# Altium project WMCB-V2_Project.PrjPCB
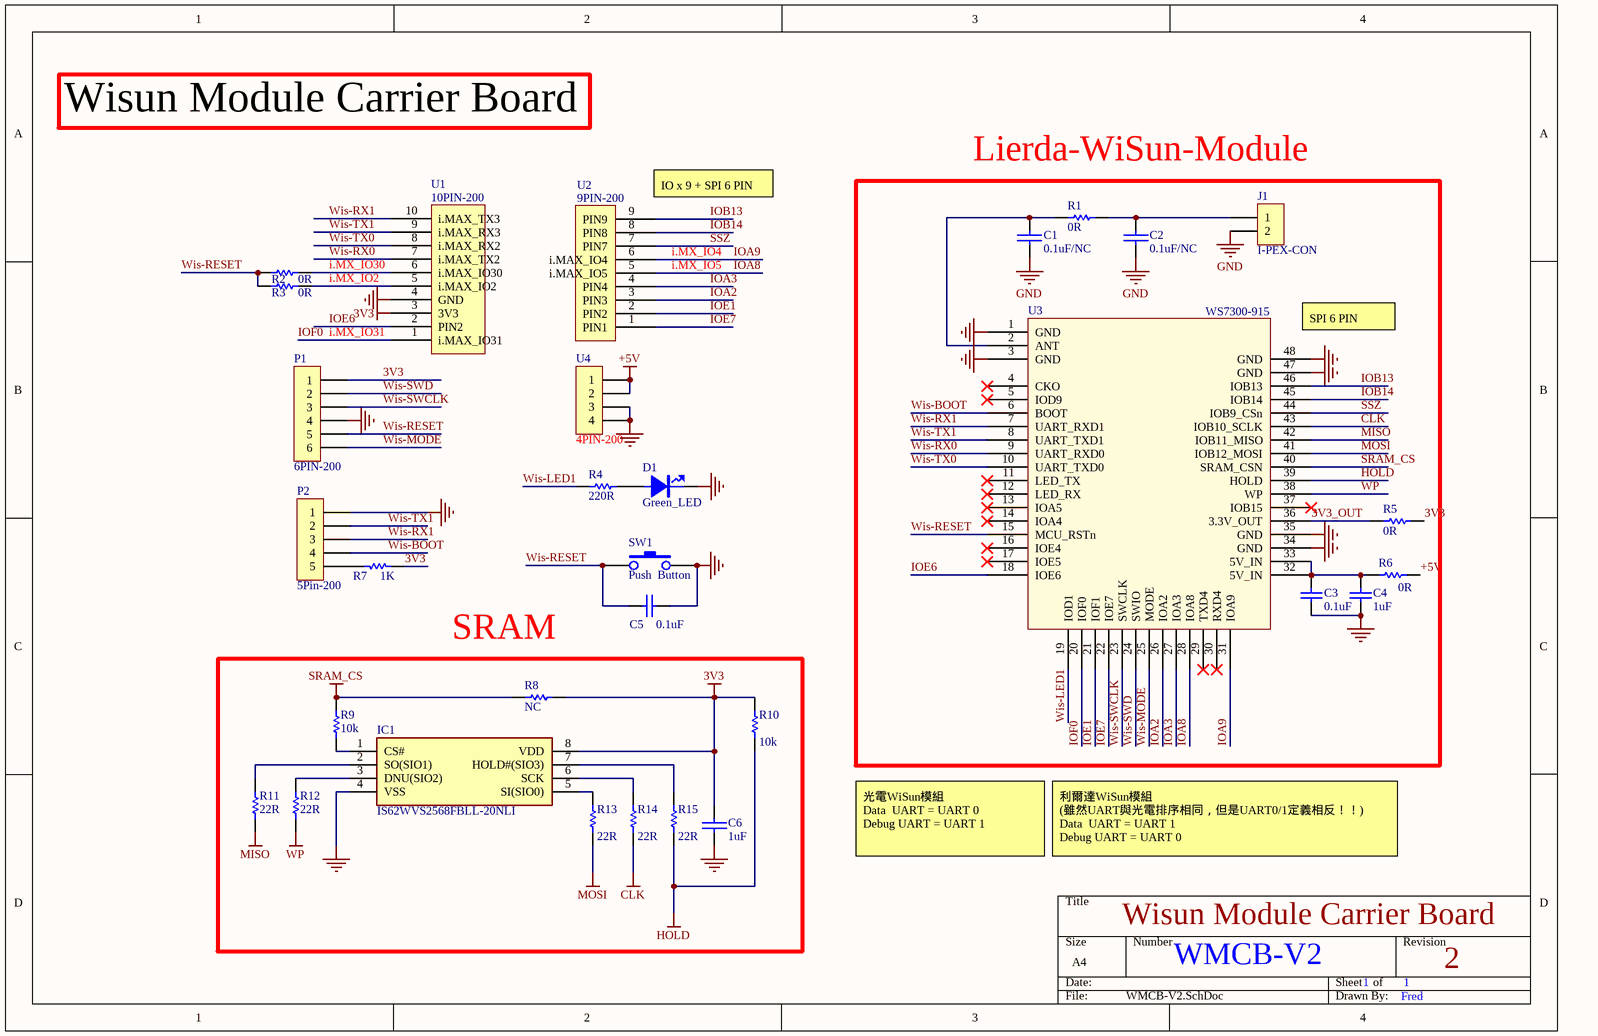
[diagram p0: WMCB-V2.SchDoc]
1 sheet, 31 parts. Net scope: global (net labels, ports and power ports of the same name join across sheets).
Board file: WMCB-V2.PcbDoc

## Sheet WMCB-V2.SchDoc
size A4

### Parts
C1  0.1uF/NC  [0402C]
C2  0.1uF/NC  [0402C]
C3  0.1uF  [0603C]
C4  value 1uF  [0603C]  (hidden comment: 0.1uF)
C5  0.1uF  [0402C]
C6  1uF  [0402C]
D1  Green_LED  [LED0603--0.4mm]
IC1  IS62WVS2568FBLL-20NLI  [SOIC127P600X175-8N]
J1  I-PEX-CON  [I-PEX-CON]
P1  6PIN-200  [6PIN-200]
P2  5Pin-200  [5pin-200]
R1  0R  [0603]
R2  0R  [0402]
R3  0R  [0402]
R4  220R  [0402]
R5  0R  [0603]
R6  0R  [0603]
R7  1K  [0402]
R8  NC  [0402]
R9  10k  [0402]
R10  10k  [0402]
R11  22R  [0402]
R12  22R  [0402]
R13  22R  [0402]
R14  22R  [0402]
R15  22R  [0402]
SW1  Push  Button  [Button_2pin-3*4*2MM]
U1  10PIN-200  [10PIN-200]
U2  9PIN-200  [9PIN-200]
U3  WS7300-915  [WiSun-Lierda]
U4  4PIN-200  [4PIN-200]

### Blocks framed on the sheet
Lierda-WiSun-Module: C1-C4 J1 R1 R5 R6 U3
SRAM: C6 IC1 R8-R15

### Nets
3V3: C6.2 IC1.8(VDD) P1.1 R5.1 R7.1 R8.1 R10.2 U1.3(3V3)
+5V: R6.1 U4.1 U4.2
CLK: R14.1 U3.43(IOB10_SCLK)
GND: C1.1 C2.1 C3.1 C4.2 C5.2 C6.1 D1.2 IC1.4(VSS) J1.2 P1.4 P2.1 SW1.2 U1.4(GND) U3.1(GND) U3.3(GND) U3.34(GND) U3.35(GND) U3.47(GND) U3.48(GND) U4.3 U4.4
HOLD: R10.1 R15.1 U3.39(HOLD)
MISO: R11.2 U3.42(IOB11_MISO)
MOSI: R13.1 U3.41(IOB12_MOSI)
SRAM_CS: R8.2 R9.1 U3.40(SRAM_CSN)
WP: R12.1 U3.38(WP)
3V3_OUT: R5.2 U3.36(3.3V_OUT)
i.MX_IO2: R3.1 U1.5(i.MAX_IO2)
i.MX_IO4: U2.6(i.MAX_IO4) U3.31(IOA9)  [also labelled IOA9]
i.MX_IO5: U2.5(i.MAX_IO5) U3.28(IOA8)  [also labelled IOA8]
i.MX_IO30: R2.1 U1.6(i.MAX_IO30)
i.MX_IO31: U1.1(i.MAX_IO31) U3.20(IOF0)  [also labelled IOF0]
IOA2: U2.3(PIN3) U3.26(IOA2)
IOA3: U2.4(PIN4) U3.27(IOA3)
IOB13: U2.9(PIN9) U3.46(IOB13)
IOB14: U2.8(PIN8) U3.45(IOB14)
IOE1: U2.2(PIN2) U3.21(IOF1)
IOE6: U1.2(PIN2) U3.18(IOE6)
IOE7: U2.1(PIN1) U3.22(IOE7)
SSZ: U2.7(PIN7) U3.44(IOB9_CSn)
Wis-BOOT: P2.4 U3.6(BOOT)
Wis-LED1: R4.2 U3.19(IOD1)
Wis-MODE: P1.6 U3.25(MODE)
Wis-RESET: C5.1 P1.5 R2.2 R3.2 SW1.1 U3.15(MCU_RSTn)
Wis-RX0: U1.7(i.MAX_TX2) U3.9(UART_RXD0)
Wis-RX1: P2.3 U1.10(i.MAX_TX3) U3.7(UART_RXD1)
Wis-SWCLK: P1.3 U3.23(SWCLK)
Wis-SWD: P1.2 U3.24(SWIO)
Wis-TX0: U1.8(i.MAX_RX2) U3.10(UART_TXD0)
Wis-TX1: P2.2 U1.9(i.MAX_RX3) U3.8(UART_TXD1)
NetC1_2: C1.2 R1.1 U3.2(ANT)
NetC2_2: C2.2 J1.1 R1.2
NetC3_2: C3.2 C4.1 R6.2 U3.32(5V_IN) U3.33(5V_IN)
NetD1_1: D1.1 R4.1
NetIC1_1: IC1.1(CS#) R9.2
NetIC1_2: IC1.2(SO(SIO1)) R11.1
NetIC1_3: IC1.3(DNU(SIO2)) R12.2
NetIC1_5: IC1.5(SI(SIO0)) R13.2
NetIC1_6: IC1.6(SCK) R14.2
NetIC1_7: IC1.7(HOLD#(SIO3)) R15.2
NetP2_5: P2.5 R7.2

Not connected (* = marked no-connect by the designer): U3 4(CKO)* 5(IOD9)* 11(LED_TX)* 12(LED_RX)* 13(IOA5)* 14(IOA4)* 16(IOE4)* 17(IOE5)* 29(TXD4)* 30(RXD4)* 37(IOB15)*

### Notes on the sheet
- Wisun Module Carrier Board
- (near U2) IO x 9 + SPI 6 PIN
- (near U3) SPI 6 PIN
- 光電WiSun模組
  Data  UART = UART 0
  Debug UART = UART 1
- 利爾達WiSun模組
  (雖然UART與光電排序相同，但是UART0/1定義相反！！)
  Data  UART = UART 1
  Debug UART = UART 0
- WMCB-V2
- 1
- 2
- Fred

### Library data of the parts
C1 C2 C6 = CAP: Capacitor
  C6: Value: 1uF
C3-C5 = Cap Semi: Capacitor (Semiconductor SIM Model); Published: 8-Jun-2000; LatestRevisionDate: 17-Jul-2002; LatestRevisionNote: Re-released for DXP Platform.; PackageReference: C1206; Publisher: Altium Limited
  C3 C5: Value: 0.1uF
D1 = LED: Manufacturer's Part Number: CL-170G-CD-T; Part Number: 41100017000; Manufacturer: Citizen; Old Part Number: 4317000; Right: 40; Bottom: 20; VALUE_ALLEGRO: Red_LED; Package Height: 1.1mm; FPLIST: mot/0805LED,dig/0805led; PCB_x: 46.095000; PCB_y: 6.420000; PCB_dir: 90.000000; Cost: 0.48
IC1 = IS62WVS2568FBLL-20NLI: Integrated Circuit; Manufacturer_Name: Integrated Silicon Solution Inc.; Datasheet Link: https://componentsearchengine.com//IS62WVS2568FBLL-20NLI.pdf; Height: 1.75mm; Mouser2 Part Number: 870-WVS2568FBLL20NLI; Mouser2 Price/Stock: https://www.mouser.com/Search/Refine.aspx?Keyword=870-WVS2568FBLL20NLI; Manufacturer_Part_Number: IS62WVS2568FBLL-20NLI
J1 = CON2: Connector
P1 = 6PIN-200: Pin Header; LatestRevisionDate: 17-Jul-2002; LatestRevisionNote: Re-released for DXP Platform.; Publisher: Altium Limited
P2 = PIN5
R1-R15 = Res Semi: Semiconductor Resistor; Published: 8-Jun-2000; LatestRevisionDate: 17-Jul-2002; LatestRevisionNote: Re-released for DXP Platform.; PackageReference: AXIAL-0.5; Publisher: Altium Limited
  R1-R3 R5 R6: Value: 0R
  R4: Value: 220R
  R7: Value: 1K
  R8: Value: NC
  R9 R10: Value: 10k
  R11-R15: Value: 22R
SW1 = SW1: Push Button; Value: Switch-SMD-6x6mm
U4 = CON4: Connector; Value: MicroUSB